# Altium schematic sheet 5_Magnetorquer_Drivers.SchDoc: DB_ADCS Magnetorquer Drivers
size A4; DrawnBy: Augusto Cezar Boldori Vassoler; Revision: V2.1; SheetNumber: 6; SheetTotal: 7
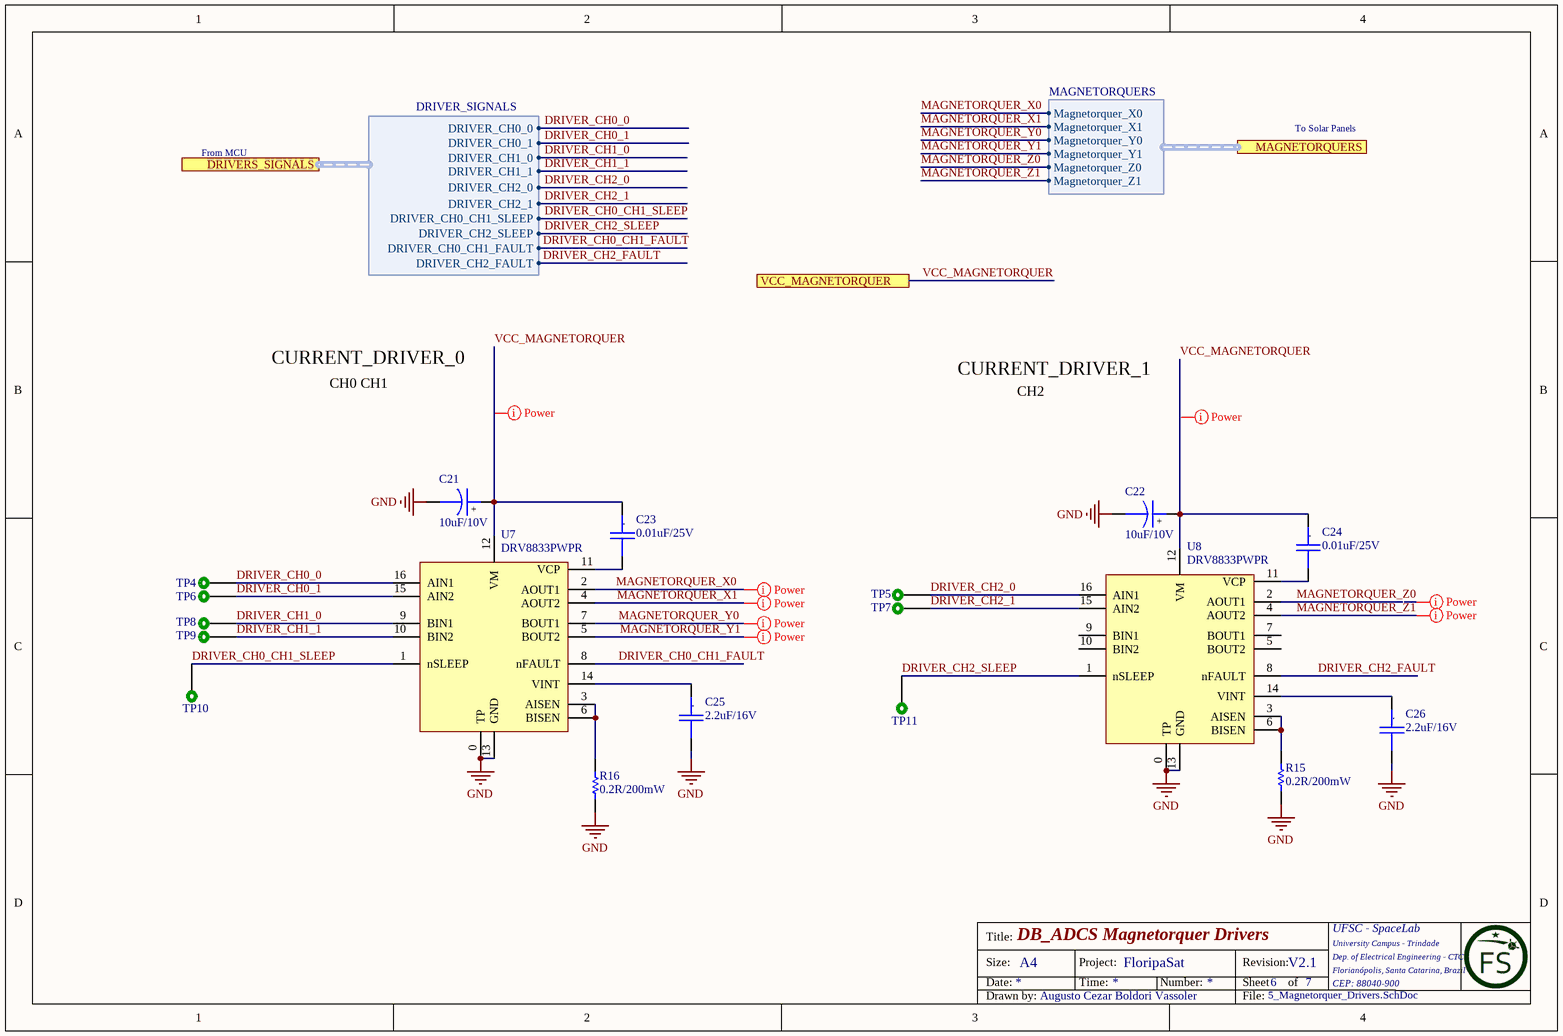
[diagram p0: 5_Magnetorquer_Drivers.SchDoc]

## Parts
C21  10uF/10V  [CC0805_Tantalum]
C22  10uF/10V  [CC0805_Tantalum]
C23  0.01uF/25V  [CC0805]
C24  0.01uF/25V  [CC0805]
C25  2.2uF/16V  [CC0805]
C26  2.2uF/16V  [CC0805]
R15  0.2R/200mW  [0805-LED]
R16  0.2R/200mW  [0805-LED]
TP4  TEST_POINT_2  [TEST_POINT_2]  (value not drawn)  (no BOM)
TP5  TEST_POINT_2  [TEST_POINT_2]  (value not drawn)  (no BOM)
TP6  TEST_POINT_2  [TEST_POINT_2]  (value not drawn)  (no BOM)
TP7  TEST_POINT_2  [TEST_POINT_2]  (value not drawn)  (no BOM)
TP8  TEST_POINT_2  [TEST_POINT_2]  (value not drawn)  (no BOM)
TP9  TEST_POINT_2  [TEST_POINT_2]  (value not drawn)  (no BOM)
TP10  TEST_POINT_2  [TEST_POINT_2]  (value not drawn)  (no BOM)
TP11  TEST_POINT_2  [TEST_POINT_2]  (value not drawn)  (no BOM)
U7  DRV8833PWPR  [16TTSSOP]
U8  DRV8833PWPR  [16TTSSOP]

## Ports
DRIVERS_SIGNALS (harness DRIVER_SIGNALS), MAGNETORQUERS (harness MAGNETORQUERS), VCC_MAGNETORQUER

## Harnesses
MAGNETORQUERS: Magnetorquer_X0, Magnetorquer_X1, Magnetorquer_Y0, Magnetorquer_Y1, Magnetorquer_Z0, Magnetorquer_Z1
DRIVER_SIGNALS: DRIVER_CH1_1, DRIVER_CH1_0, DRIVER_CH0_1, DRIVER_CH0_0, DRIVER_CH2_0, DRIVER_CH2_1, DRIVER_CH0_CH1_SLEEP, DRIVER_CH2_SLEEP, DRIVER_CH0_CH1_FAULT, DRIVER_CH2_FAULT

## Nets
GND: C21.2 C22.2 C25.2 C26.2 R15.1 R16.1 U7.0(TP) U7.13(GND) U8.0(TP) U8.13(GND)
DRIVER_CH0_0: TP4.1 U7.16(AIN1) ; port DRIVERS_SIGNALS.DRIVER_CH0_0
DRIVER_CH0_1: TP6.1 U7.15(AIN2) ; port DRIVERS_SIGNALS.DRIVER_CH0_1
DRIVER_CH0_CH1_FAULT: U7.8(nFAULT) ; port DRIVERS_SIGNALS.DRIVER_CH0_CH1_FAULT
DRIVER_CH0_CH1_SLEEP: TP10.1 U7.1(nSLEEP) ; port DRIVERS_SIGNALS.DRIVER_CH0_CH1_SLEEP
DRIVER_CH1_0: TP8.1 U7.9(BIN1) ; port DRIVERS_SIGNALS.DRIVER_CH1_0
DRIVER_CH1_1: TP9.1 U7.10(BIN2) ; port DRIVERS_SIGNALS.DRIVER_CH1_1
DRIVER_CH2_0: TP5.1 U8.16(AIN1) ; port DRIVERS_SIGNALS.DRIVER_CH2_0
DRIVER_CH2_1: TP7.1 U8.15(AIN2) ; port DRIVERS_SIGNALS.DRIVER_CH2_1
DRIVER_CH2_FAULT: U8.8(nFAULT) ; port DRIVERS_SIGNALS.DRIVER_CH2_FAULT
DRIVER_CH2_SLEEP: TP11.1 U8.1(nSLEEP) ; port DRIVERS_SIGNALS.DRIVER_CH2_SLEEP
MAGNETORQUER_X0: U7.2(AOUT1) ; port MAGNETORQUERS.Magnetorquer_X0
MAGNETORQUER_X1: U7.4(AOUT2) ; port MAGNETORQUERS.Magnetorquer_X1
MAGNETORQUER_Y0: U7.7(BOUT1) ; port MAGNETORQUERS.Magnetorquer_Y0
MAGNETORQUER_Y1: U7.5(BOUT2) ; port MAGNETORQUERS.Magnetorquer_Y1
MAGNETORQUER_Z0: U8.2(AOUT1) ; port MAGNETORQUERS.Magnetorquer_Z0
MAGNETORQUER_Z1: U8.4(AOUT2) ; port MAGNETORQUERS.Magnetorquer_Z1
VCC_MAGNETORQUER: C21.1 C22.1 C23.1 C24.1 U7.12(VM) U8.12(VM) ; port VCC_MAGNETORQUER
NetC23_2: C23.2 U7.11(VCP)
NetC24_2: C24.2 U8.11(VCP)
NetC25_1: C25.1 U7.14(VINT)
NetC26_1: C26.1 U8.14(VINT)
NetR15_2: R15.2 U8.3(AISEN) U8.6(BISEN)
NetR16_2: R16.2 U7.3(AISEN) U7.6(BISEN)

Not connected (* = marked no-connect by the designer): U8 5(BOUT2) 7(BOUT1) 9(BIN1) 10(BIN2)

## Layout directives
net class Power: (no net found under the mark), MAGNETORQUER_X0, MAGNETORQUER_X1, MAGNETORQUER_Y0, MAGNETORQUER_Y1, MAGNETORQUER_Z1, VCC_MAGNETORQUER

## Notes on the sheet
- From MCU
- To Solar Panels
- CURRENT_DRIVER_0
- CURRENT_DRIVER_1
- CH0 CH1
- CH2
- Title:
- Size:
- Date:
- A4
- Project:
- Time:
- FloripaSat
- Number:
- Revision:
- Sheet
- of
- UFSC - SpaceLab
- University Campus - Trindade
- Dep. of Electrical Engineering - CTC
- Florianópolis, Santa Catarina, Brazil
- CEP: 88040-900
- Drawn by:
- File:
- (in symbol Cap_Cer_X7R_0.01uF_50V_0805) .
- (in symbol Cap_Cer_X7R_2.2uF_16V_0805) .
- (in symbol Cap_Tant_SMD_10uF_6V3_0805) +

## Library data of the parts
C21 C22 = Cap_Tant_SMD_10uF_6V3_0805: CAP Tantalum 10uF 6.3V 10% 0805; Partnumber: TPSR106K006R1000; NCM: 8532.21.11
C23 C24 = Cap_Cer_X7R_0.01uF_50V_0805: CAP CER 0.01uF 25V 10% X7R 0805; Partnumber: CL21B103KAANNNC; NCM: 8532.24.10
C25 C26 = Cap_Cer_X7R_2.2uF_16V_0805: CAP CER 2.2uF 16V 0805; Partnumber: C2012X7R1C225K125AB; NCM: 8532.24.10
R15 R16 = R0.015R_1%_0.5W_0805: RES 0.2 OHM - 0.2W 1% 0805; Partnumber: RL1220S-R20-F; NCM: 8533.21.20
TP4-TP11 = TEST_POINT_2: Test point
U7 U8 = DRV8833PWPR: Partnumber: DRV8833PWPR